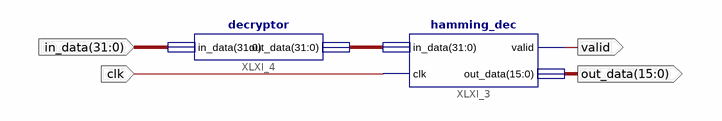
[diagram p0: schematic sheet 1]
// Xilinx ISE schematic rtn.sch (spartan6) as structural Verilog: 2 symbols, 4 ports
module rtn (
  input  [31:0] in_data,
  input  clk,
  output [15:0] out_data,
  output valid
);

  wire [31:0] XLXN_2;

  hamming_dec XLXI_3 (.in_data(XLXN_2), .clk(clk), .valid(valid), .out_data(out_data));
  decryptor XLXI_4 (.in_data(in_data), .out_data(XLXN_2));
endmodule
